# Altium schematic sheet Transient Surge Device.SchDoc
size B; Organization: Altium Limited; Address1: L3, 12a Rodborough Rd; Address2: Frenchs Forest; Address3: NSW; Address4: Australia 2086; SheetNumber: 1; SheetTotal: 1
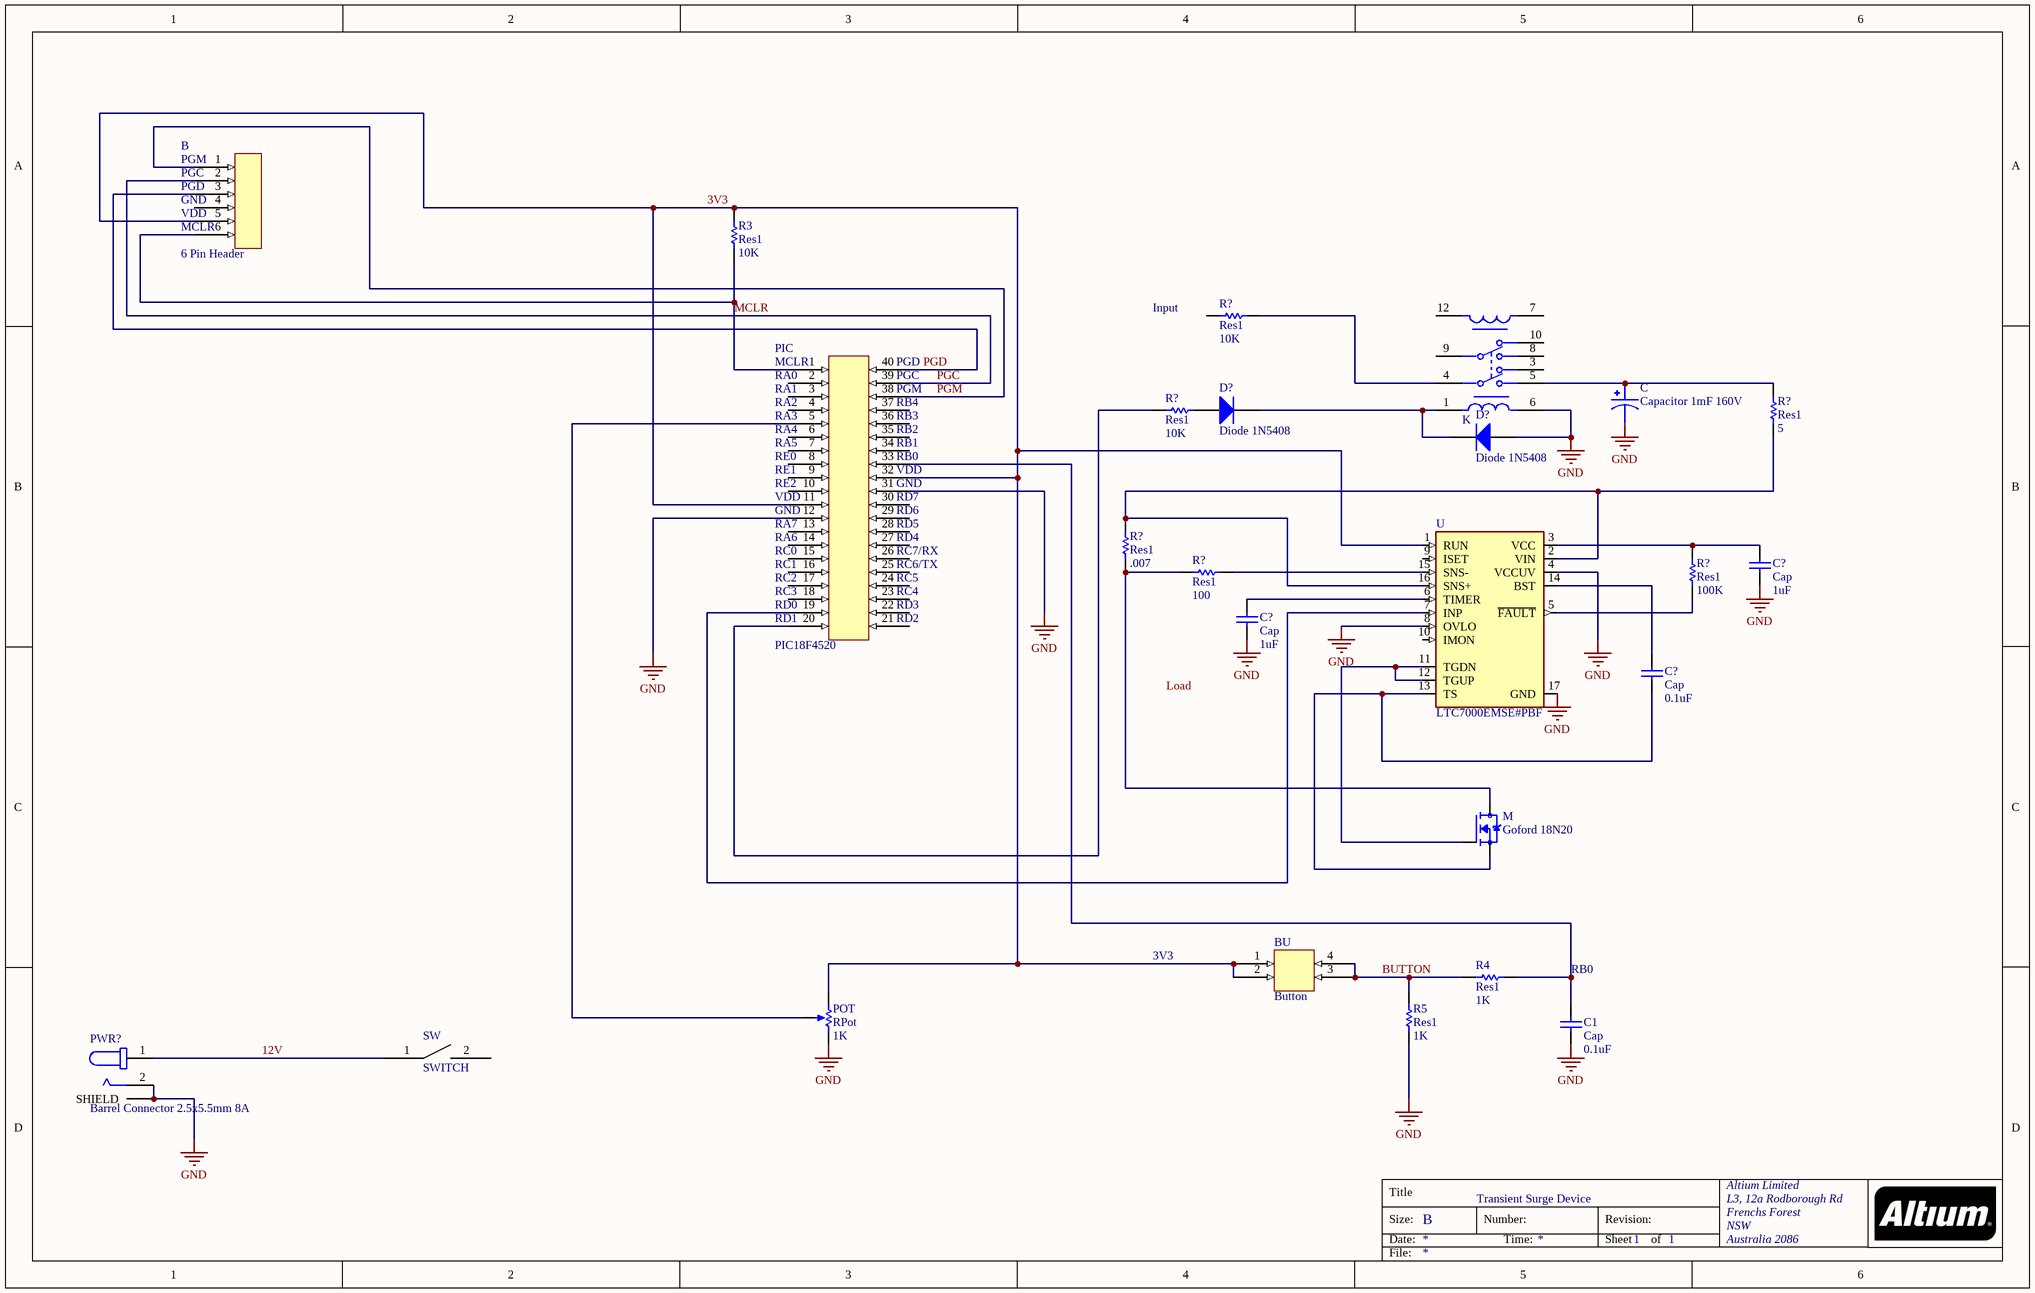
[diagram p0: Transient Surge Device.SchDoc]

## Parts
(Parts that share a designator on the sheet are numbered #1, #2 ... from top to bottom, then left to right.)
?  6 Pin Header  [6 Pin Header]  (part B of 2)
BU  Button  [Button]
C  Capacitor 1mF 160V  [1 mF 160V Elec Cap]
C1  Cap  value 0.1uF  [RAD-0.3]
C?#1  Cap  value 1uF  [RAD-0.3]
C?#2  Cap  value 1uF  [RAD-0.3]
C?#3  Cap  value 0.1uF  [RAD-0.3]
D?#1  Diode 1N5408  [DO-201AD]
D?#2  Diode 1N5408  [DO-201AD]
K  TXS2-L2-3V  [Panasonic_0_MFG]  (value not drawn)
M  Goford 18N20  [Goford 18N20]
PIC  PIC18F4520  [PIC18F4520]
POT  RPot  value 1K  [VR5]
PWR?  Barrel Connector 2.5x5.5mm 8A  [Barrel Connector 2.5x5.5mm 8A]
R3  Res1  value 10K  [AXIAL-0.3]
R4  Res1  value 1K  [AXIAL-0.3]
R5  Res1  value 1K  [AXIAL-0.3]
R?#1  Res1  value 10K  [AXIAL-0.3]
R?#2  Res1  value 5  [AXIAL-0.3]
R?#3  Res1  value 10K  [AXIAL-0.3]
R?#4  Res1  value .007  [AXIAL-0.3]
R?#5  Res1  value 100  [AXIAL-0.3]
R?#6  Res1  value 100K  [AXIAL-0.3]
SW  SWITCH  [SWITCH]
U  LTC7000EMSE#PBF  [SOP50P490X110-17N]

## Nets
GND: C.2 C1.2 C?#1.2 C?#2.2 D?#2.1(A) K.6(S-) PIC.12 PIC.31 POT.2(BOT) PWR?.2 PWR?.S1(SHIELD) PWR?.S2(SHIELD) R5.2 U.4(VCCUV) U.8(OVLO) U.17(GND)
3V3: ?.5 BU.1 BU.2 PIC.11 PIC.32 POT.1(TOP) R3.2 U.1(RUN)
12V: PWR?.1 SW.1
BUTTON: BU.3 BU.4 R4.1 R5.1
MCLR: ?.2 ?.6 PIC.1 PIC.39 R3.1  [also labelled PGC]
PGD: ?.3 PIC.40
PGM: ?.1 PIC.38
NetC1_1: C1.1 PIC.33 R4.2
NetC?#1_1: C?#1.1 R?#6.2 U.3(VCC)
NetC?#2_1: C?#2.1 U.6(TIMER)
NetC?#3_1: C?#3.1 U.14(BST)
NetC?#3_2: C?#3.2 M.3(S) U.13(TS)
NetC_1: C.1 K.5 R?#2.1
NetD?#1_2: D?#1.2(K) D?#2.2(K) K.1(S+)
NetK_4: K.4 R?#1.1
NetM_1: M.1(G) U.11(TGDN) U.12(TGUP)
NetM_2: M.2(D) R?#4.1 R?#5.2
NetPIC_5: PIC.5 POT.3(TAP)
NetPIC_19: PIC.19 U.7(INP)
NetPIC_20: PIC.20 R?#3.2
NetR?#2_2: R?#2.2 R?#4.2 U.2(VIN) U.16(SNS+)
NetR?#5_1: R?#5.1 U.15(SNS-)
NetR?#6_1: R?#6.1 U.5(~{FAULT})

Not connected (* = marked no-connect by the designer): ? 4; D?#1 1(A); K 3 7(R-) 8 9 10 12(R+); PIC 2 3 4 6 7 8 9 10 13 14 15 16 17 18 21 22 23 24 25 26 27 28 29 30 34 35 36 37; R?#1 2; R?#3 1; SW 2; U 9(ISET) 10(IMON)

## Notes on the sheet
- (near R?#1) Input
- 3V3
- (near C1) RB0
- Transient Surge Device
- Labels drawn without touching a wire or pin: Load
- Title
- Size:
- Date:
- B
- Number:
- Time:
- Revision:
- Sheet
- of
- File:
- (in symbol 6 Pin Header, part B) PGM; PGC; PGD; GND; VDD; MCLR
- (in symbol PIC18F4520) MCLR; PGD; RA0; PGC; RA1; PGM; RA2; RB4; RA3; RB3; RA4; RB2; RA5; RB1; RE0; RB0; RE1; VDD; RE2; GND; RD7; RD6; RA7; RD5; RA6; RD4; RC0; RC7/RX; RC1; RC6/TX; RC2; RC5; RC3; RC4; RD0; RD3; RD1; RD2

## Library data of the parts
C = Capacitor 1mF 160V: United Chemi-Con EKMQ161VSN102MP40S; MP: 478CKS010M; MF: Illinois Capacitor; SnapEDA_Link: https://www.snapeda.com/parts/478CKS010M/Illinois%20Capacitor/view-part/2347563/?ref=snap; Price: None; Mouser-Purchase-URL: https://snapeda.com/shop?store=Mouser&id=2347563; Availability: Warning; Package: Radial Illinois Capacitor; Value: *
C1 C?#1-C?#3 = Cap: Capacitor; Published: 8-Jun-2000; LatestRevisionDate: 17-Jul-2002; LatestRevisionNote: Re-released for DXP Platform.; PackageReference: RAD-0.3; Publisher: Altium Limited; PackageDescription: Radial Cap, Thru-Hole; 2 Leads; 0.3 in Pin Spacing
D?#1 D?#2 = Diode 1N5408: 3 Amp Medium Power Silicon Rectifier Diode; Published: 8-Jun-2000; LatestRevisionDate: 17-Jul-2002; LatestRevisionNote: Re-released for DXP Platform.; DatasheetVersion: Aug-1984; PackageReference: DO-201AD; Publisher: Altium Limited; PackageDescription: Diode, Axial; Body 9.5 x 5.3 mm (LxDia. max), Lead Dia. 1.32 mm (max); ComponentLink1Description: Manufacturer Link; ComponentLink1URL: http://www.irf.com/
K = Relay TXS2-L2-3V: General Purpose Relay DPDT (2 Form C) Through Hole; Manufacturer: Panasonic; Coil Current: 23.3mA; Coil Power: 70mW; Coil Resistance: 129Ω; Coil Type: Latching and Dual Coil; Coil Voltage: 3V; Current Rating: 1A; Number Of Contacts: 2; Standoff Height: 0.35mm; Switching Power: 30W; Symbol Hash: c70ae37567036b3a3dad33d53ba471e1a22493a1cf93c3fc7342c0c53b9a3fa4; Verification Version: 0.0.0.3; Datasheet Path: datasheets/Relay_Panasonic_TXS2-L2-3V_eec.pdf; Ambient Temperature Range High: +70°C; Ambient Temperature Range Low: -40°C; Automotive: No; ComponentLink1Description: Upverter; ComponentLink1URL: https://upverter.com/part/id/2093f600a86d567a/; ComponentLink2Description: Datasheet; ComponentLink2URL: https://www.panasonic-electric-works.com/pew/eu/downloads/ds_61022_en_txs.pdf; Digikey Description: RELAY GEN PURPOSE DPDT 1A 3VDC; Digikey Part Number: 255-2339-5-ND; Height: 8.5mm; Lead Free: Yes; Mouser Description: Low Signal Relays - PCB 2 Form C 2A 30VDC 3VDC; Mouser Part Number: 769-TXS2-L2-3V; Package: 0; Part Number: TXS2-L2-3V; RoHS: TRUE; Supplier 1: Digi-Key; Supplier 2: Mouser; Supplier Part Number 1: 255-2339-5-ND; Supplier Part Number 2: 769-TXS2-L2-3V; Switching Current: 1A; Temperature: -40°C to +70°C; Temperature Range High: +70°C; Temperature Range Low: -40°C; Throw Configuration: DPDT; helpURL: https://upverter.com/part/id/2093f600a86d567a/
M = Goford 18N20: N-Channel 200V 18A; MF: Infineon; MP: IRFZ44NPBF; Purchase-URL: https://pricing.snapeda.com/search/part/IRFZ44NPBF/?ref=eda; SnapEDA_Link: https://www.snapeda.com/parts/IRFZ44NPBF/Infineon+Technologies/view-part/?ref=snap; Value: *; Package: TO-220-3 Infineon; Digi-Key_Part_Number: IRFZ44NPBF-ND; Check_prices: https://www.snapeda.com/parts/IRFZ44NPBF/Infineon+Technologies/view-part/?ref=eda
POT = RPot: Potentiometer; Sim Note: Enter the Resistance value and the set point into parameter fields.; Set Position: 0.5; Published: 8-Jun-2000; LatestRevisionDate: 17-Jul-2002; LatestRevisionNote: Re-released for DXP Platform.; PackageReference: VR5; Publisher: Altium Limited; PackageDescription: Variable Resistor, Thru-Hole; 3 Leads
PWR? = Barrel Connector 2.5x5.5mm 8A: 2.5 x 5.5 mm, 8.0 A, / CUI Devices PJ-063BH; Price: None; SnapEDA_Link: https://www.snapeda.com/parts/PJ-063BH/CUI%20Devices/view-part/703426/?ref=snap; MP: PJ-063BH; Availability: Unavailable; Value: *; Package: None; MF: CUI Devices
R3-R5 R?#1-R?#6 = Res1: Resistor; Published: 8-Jun-2000; LatestRevisionDate: 17-Jul-2002; LatestRevisionNote: Re-released for DXP Platform.; PackageReference: AXIAL-0.3; Publisher: Altium Limited; PackageDescription: Axial Device, Thru-Hole; 2 Leads; 0.3 in Pin Spacing
U = LTC7000EMSE#PBF: High-Side Gate Driver IC Non-Inverting 16-MSOP-EP; MF: Linear Technology/Analog; Package: MSOP-16 Linear Technology; Value: *; SnapEDA_Link: https://www.snapeda.com/parts/LTC7000EMSE%23PBF/Analog%20Devices/view-part/2682178/?ref=snap; MP: LTC7000EMSE#PBF